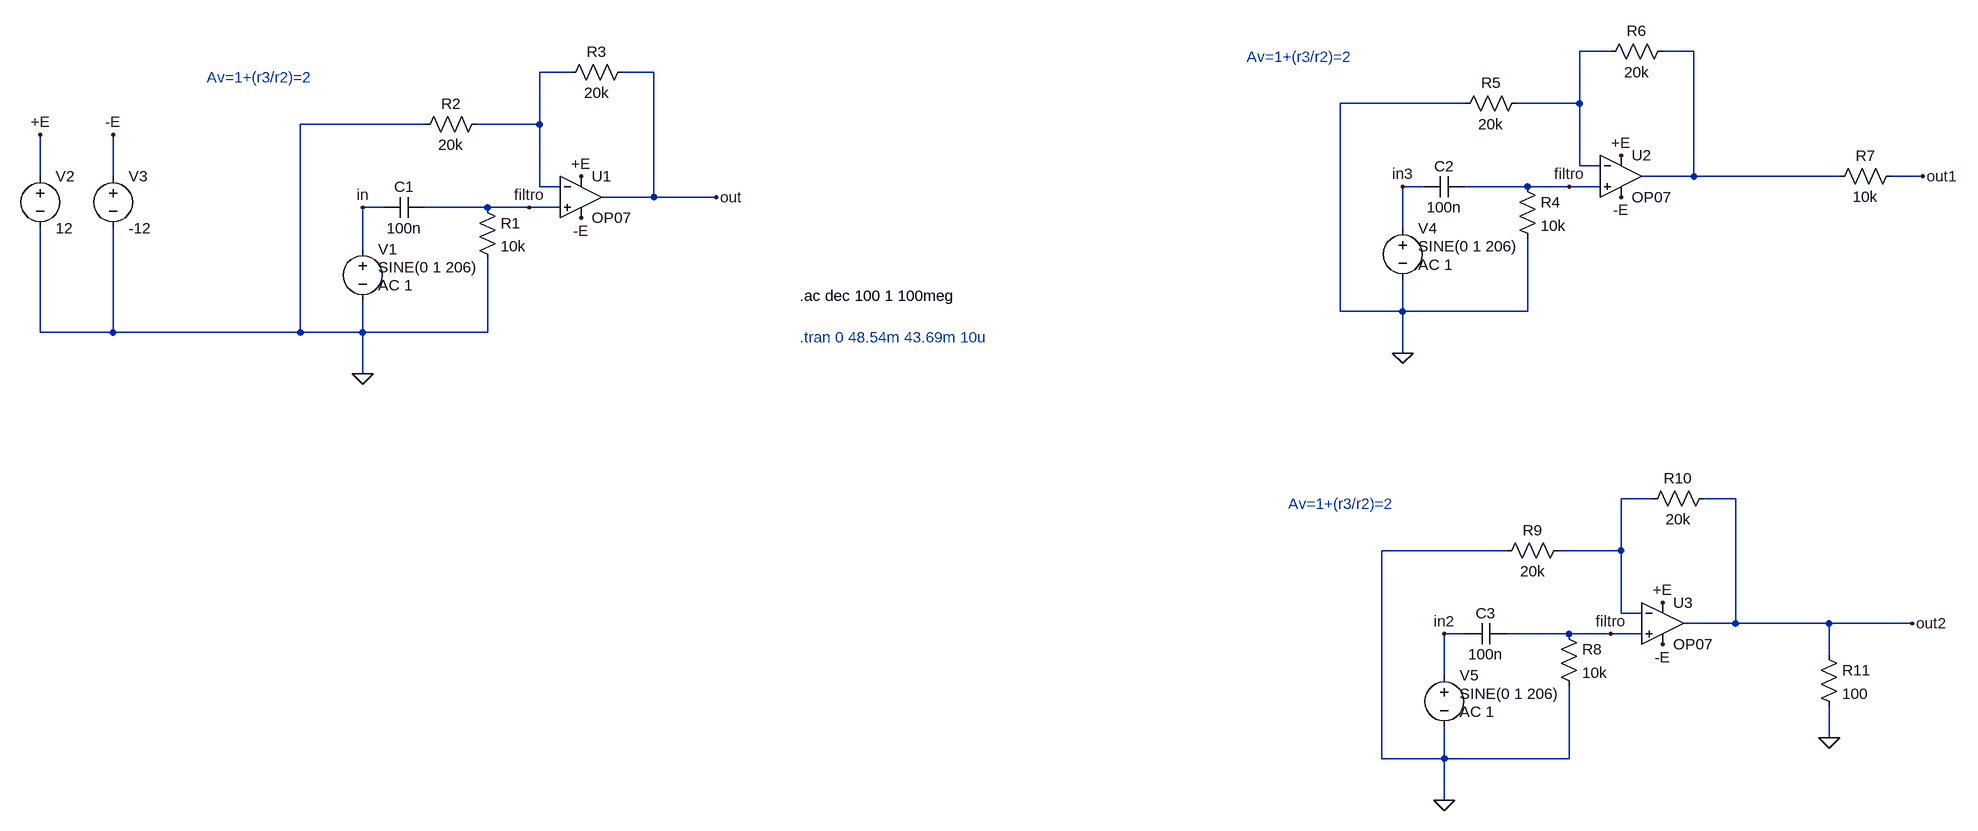
[diagram p0: schematic filto-passa-alto-rc-attivo-reale.asc]
filto-passa-alto-rc-attivo-reale.asc, the LTspice schematic file:
Version 4.1
SHEET 1 2500 1156
WIRE 1936 -16 1888 -16
WIRE 2064 -16 2016 -16
WIRE 336 16 288 16
WIRE 464 16 416 16
WIRE 1712 64 1520 64
WIRE 1888 64 1888 -16
WIRE 1888 64 1792 64
WIRE 112 96 -80 96
WIRE 288 96 288 16
WIRE 288 96 192 96
WIRE 1888 160 1888 64
WIRE 1920 160 1888 160
WIRE -480 176 -480 112
WIRE -368 176 -368 112
WIRE 2064 176 2064 -16
WIRE 2064 176 1984 176
WIRE 2288 176 2064 176
WIRE 2416 176 2368 176
WIRE 288 192 288 96
WIRE 320 192 288 192
WIRE 1648 192 1616 192
WIRE 1808 192 1712 192
WIRE 1872 192 1808 192
WIRE 1920 192 1872 192
WIRE 464 208 464 16
WIRE 464 208 384 208
WIRE 560 208 464 208
WIRE 48 224 16 224
WIRE 208 224 112 224
WIRE 272 224 208 224
WIRE 320 224 272 224
WIRE 1616 256 1616 192
WIRE 16 288 16 224
WIRE 1520 384 1520 64
WIRE 1616 384 1616 336
WIRE 1616 384 1520 384
WIRE 1808 384 1808 272
WIRE 1808 384 1616 384
WIRE -480 416 -480 256
WIRE -368 416 -368 256
WIRE -368 416 -480 416
WIRE -80 416 -80 96
WIRE -80 416 -368 416
WIRE 16 416 16 368
WIRE 16 416 -80 416
WIRE 208 416 208 304
WIRE 208 416 16 416
WIRE 1616 448 1616 384
WIRE 16 480 16 416
WIRE 2000 672 1952 672
WIRE 2128 672 2080 672
WIRE 1776 752 1584 752
WIRE 1952 752 1952 672
WIRE 1952 752 1856 752
WIRE 1952 848 1952 752
WIRE 1984 848 1952 848
WIRE 2128 864 2128 672
WIRE 2128 864 2048 864
WIRE 2272 864 2128 864
WIRE 2400 864 2272 864
WIRE 1712 880 1680 880
WIRE 1872 880 1776 880
WIRE 1936 880 1872 880
WIRE 1984 880 1936 880
WIRE 2272 912 2272 864
WIRE 1680 944 1680 880
WIRE 2272 1040 2272 992
WIRE 1584 1072 1584 752
WIRE 1680 1072 1680 1024
WIRE 1680 1072 1584 1072
WIRE 1872 1072 1872 960
WIRE 1872 1072 1680 1072
WIRE 1680 1136 1680 1072
FLAG 16 480 0
FLAG 560 208 out
FLAG 16 224 in
FLAG -480 112 +E
FLAG -368 112 -E
FLAG 272 224 filtro
FLAG 352 176 +E
FLAG 352 240 -E
FLAG 2272 1040 0
FLAG 2416 176 out1
FLAG 2400 864 out2
FLAG 1616 448 0
FLAG 1616 192 in3
FLAG 1872 192 filtro
FLAG 1952 144 +E
FLAG 1952 208 -E
FLAG 1680 1136 0
FLAG 1680 880 in2
FLAG 1936 880 filtro
FLAG 2016 832 +E
FLAG 2016 896 -E
SYMBOL cap 112 208 R90
WINDOW 0 0 32 VBottom 2
WINDOW 3 32 32 VTop 2
SYMATTR InstName C1
SYMATTR Value 100n
SYMBOL res 192 208 R0
SYMATTR InstName R1
SYMATTR Value 10k
SYMBOL res 208 80 R90
WINDOW 0 0 56 VBottom 2
WINDOW 3 32 56 VTop 2
SYMATTR InstName R2
SYMATTR Value 20k
SYMBOL res 432 0 R90
WINDOW 0 0 56 VBottom 2
WINDOW 3 32 56 VTop 2
SYMATTR InstName R3
SYMATTR Value 20k
SYMBOL voltage 16 272 R0
WINDOW 3 24 44 Left 2
WINDOW 123 24 72 Left 2
WINDOW 39 0 0 Left 0
SYMATTR Value SINE(0 1 206)
SYMATTR Value2 AC 1
SYMATTR InstName V1
SYMBOL voltage -480 160 R0
WINDOW 123 0 0 Left 0
WINDOW 39 0 0 Left 0
SYMATTR InstName V2
SYMATTR Value 12
SYMBOL voltage -368 160 R0
WINDOW 123 0 0 Left 0
WINDOW 39 0 0 Left 0
SYMATTR InstName V3
SYMATTR Value -12
SYMBOL res 2384 160 R90
WINDOW 0 0 56 VBottom 2
WINDOW 3 32 56 VTop 2
SYMATTR InstName R7
SYMATTR Value 10k
SYMBOL res 2256 896 R0
SYMATTR InstName R11
SYMATTR Value 100
SYMBOL OpAmps\\OP07 352 144 R0
SYMATTR InstName U1
SYMBOL cap 1712 176 R90
WINDOW 0 0 32 VBottom 2
WINDOW 3 32 32 VTop 2
SYMATTR InstName C2
SYMATTR Value 100n
SYMBOL res 1792 176 R0
SYMATTR InstName R4
SYMATTR Value 10k
SYMBOL res 1808 48 R90
WINDOW 0 0 56 VBottom 2
WINDOW 3 32 56 VTop 2
SYMATTR InstName R5
SYMATTR Value 20k
SYMBOL res 2032 -32 R90
WINDOW 0 0 56 VBottom 2
WINDOW 3 32 56 VTop 2
SYMATTR InstName R6
SYMATTR Value 20k
SYMBOL voltage 1616 240 R0
WINDOW 3 24 44 Left 2
WINDOW 123 24 72 Left 2
WINDOW 39 0 0 Left 0
SYMATTR Value SINE(0 1 206)
SYMATTR Value2 AC 1
SYMATTR InstName V4
SYMBOL OpAmps\\OP07 1952 112 R0
SYMATTR InstName U2
SYMBOL cap 1776 864 R90
WINDOW 0 0 32 VBottom 2
WINDOW 3 32 32 VTop 2
SYMATTR InstName C3
SYMATTR Value 100n
SYMBOL res 1856 864 R0
SYMATTR InstName R8
SYMATTR Value 10k
SYMBOL res 1872 736 R90
WINDOW 0 0 56 VBottom 2
WINDOW 3 32 56 VTop 2
SYMATTR InstName R9
SYMATTR Value 20k
SYMBOL res 2096 656 R90
WINDOW 0 0 56 VBottom 2
WINDOW 3 32 56 VTop 2
SYMATTR InstName R10
SYMATTR Value 20k
SYMBOL voltage 1680 928 R0
WINDOW 3 24 44 Left 2
WINDOW 123 24 72 Left 2
WINDOW 39 0 0 Left 0
SYMATTR Value SINE(0 1 206)
SYMATTR Value2 AC 1
SYMATTR InstName V5
SYMBOL OpAmps\\OP07 2016 800 R0
SYMATTR InstName U3
TEXT -224 24 Left 2 ;Av=1+(r3/r2)=2
TEXT 688 360 Left 2 !.ac dec 100 1 100meg
TEXT 688 424 Left 2 ;.tran 0 48.54m 43.69m 10u
TEXT 1376 -8 Left 2 ;Av=1+(r3/r2)=2
TEXT 1440 680 Left 2 ;Av=1+(r3/r2)=2

The netlist it stands for:
* filto-passa-alto-rc-attivo-reale.asc
C1 filtro in 100n
R1 filtro 0 10k
R2 N003 0 20k
R3 out N003 20k
V1 in 0 SINE(0 1 206) AC 1
V2 +E 0 12
V3 -E 0 -12
R7 out1 N002 10k
R11 out2 0 100
X§U1 filtro N003 +E -E out LT1001  ; OP07, pins In+ In- V+ V- OUT
C2 filtro in3 100n
R4 filtro 0 10k
R5 N001 0 20k
R6 N002 N001 20k
V4 in3 0 SINE(0 1 206) AC 1
X§U2 filtro N001 +E -E N002 LT1001  ; OP07, pins In+ In- V+ V- OUT
C3 filtro in2 100n
R8 filtro 0 10k
R9 N004 0 20k
R10 out2 N004 20k
V5 in2 0 SINE(0 1 206) AC 1
X§U3 filtro N004 +E -E out2 LT1001  ; OP07, pins In+ In- V+ V- OUT
* Av=1+(r3/r2)=2
.ac dec 100 1 100meg
* .tran 0 48.54m 43.69m 10u
* Av=1+(r3/r2)=2
* Av=1+(r3/r2)=2
.lib LTC.lib
.backanno
.end

* Results of the author's LTspice run, read from the files saved beside the schematic
* Operating Point, zero values left out:
*   V(+e) = 12 V
*   V(-e) = -12 V
*   I(V2) = -6.75 mA
*   I(V3) = 6.75 mA
*   Ix(u1:3) = 2.25 mA
*   Ix(u1:4) = -2.25 mA
*   Ix(u2:3) = 2.25 mA
*   Ix(u2:4) = -2.25 mA
*   Ix(u3:3) = 2.25 mA
*   Ix(u3:4) = -2.25 mA
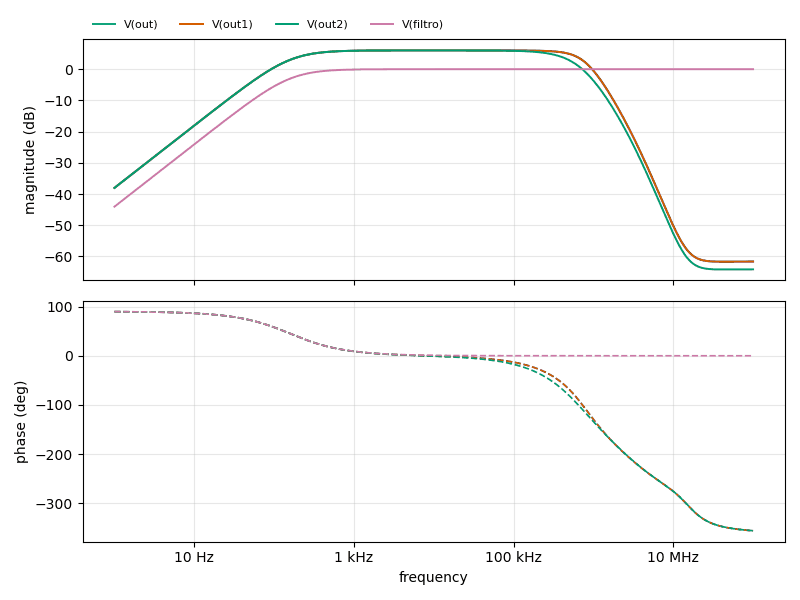
[diagram p1: AC Analysis of filto-passa-alto-rc-attivo-reale.asc, plotted from the saved traces]
* AC Analysis, 1 run:
*   V(out): -38.02 dB at 1 Hz, -61.62 dB at 100 MHz, peak 6.02 dB at 15.14 kHz, 3 dB below the peak at 159.1 Hz and 717.3 kHz
*   V(out1): -38.02 dB at 1 Hz, -61.62 dB at 100 MHz, peak 6.02 dB at 15.14 kHz, 3 dB below the peak at 159.1 Hz and 717.3 kHz
*   V(out2): -38.02 dB at 1 Hz, -64.12 dB at 100 MHz, peak 6.02 dB at 9.55 kHz, 3 dB below the peak at 159.1 Hz and 486 kHz
*   V(filtro): -44.04 dB at 1 Hz, -0.00 dB at 100 MHz, peak -0.00 dB at 131.8 kHz, 3 dB below the peak at 159.2 Hz